# Altium schematic sheet 06 - USB.SchDoc
size A4
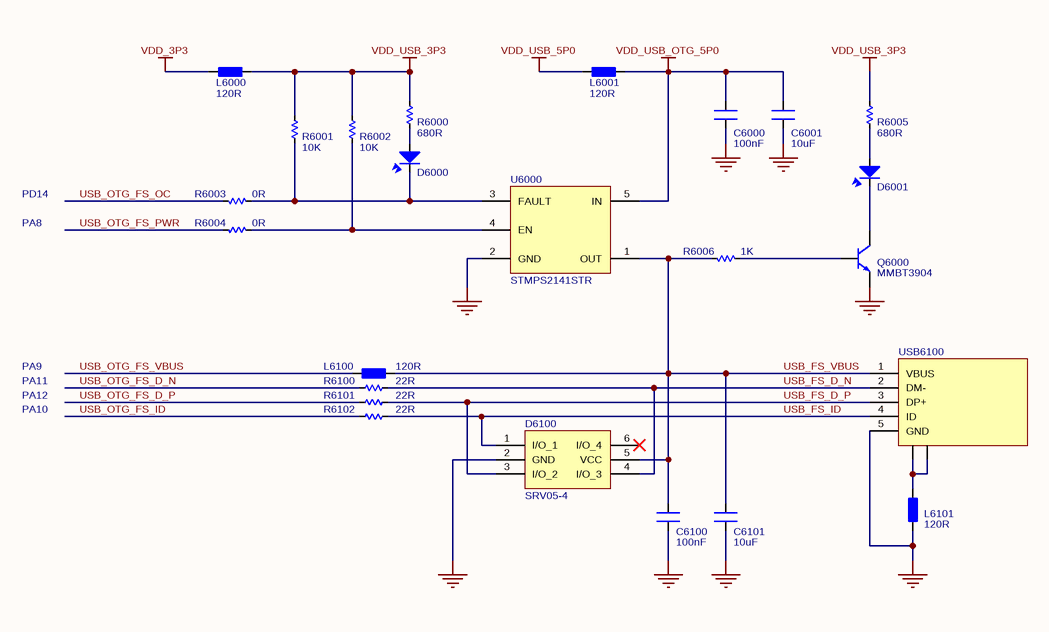
[diagram p0: 06 - USB.SchDoc]

## Parts
C6000  value 100nF  [CN-SMD-0402]  (hidden comment: Capacitor)
C6001  value 10uF  [CN-SMD-0603]  (hidden comment: Capacitor)
C6100  value 100nF  [CN-SMD-0603]  (hidden comment: Capacitor)
C6101  value 10uF  [CN-SMD-0603]  (hidden comment: Capacitor)
D6000  LED  [LED-SMD-0805-RED]  (value not drawn)
D6001  LED  [LED-SMD-0805-GREEN]  (value not drawn)
D6100  SRV05-4  [SOT95P280X145-6N]
L6000  value 120R  [L-SMD-0402]  (hidden comment: Ferrite bead)
L6001  value 120R  [L-SMD-0603]  (hidden comment: Ferrite bead)
L6100  value 120R  [L-SMD-0603]  (hidden comment: Ferrite bead)
L6101  value 120R  [L-SMD-0603]  (hidden comment: Ferrite bead)
Q6000  MMBT3904  [SOT-23-3]
R6000  value 680R  [RES-SMD-0402]  (hidden comment: Resistor)
R6001  value 10K  [RES-SMD-0402]  (hidden comment: Resistor)
R6002  value 10K  [RES-SMD-0402]  (hidden comment: Resistor)
R6003  value 0R  [RES-SMD-0402]  (hidden comment: Resistor)
R6004  value 0R  [RES-SMD-0402]  (hidden comment: Resistor)
R6005  value 680R  [RES-SMD-0402]  (hidden comment: Resistor)
R6006  value 1K  [RES-SMD-0402]  (hidden comment: Resistor)
R6100  value 22R  [RES-SMD-0402]  (hidden comment: Resistor)
R6101  value 22R  [RES-SMD-0402]  (hidden comment: Resistor)
R6102  value 22R  [RES-SMD-0402]  (hidden comment: Resistor)
U6000  STMPS2141STR  [SOT95P280X145-5N]
USB6100  USB  [USB_micro-B_F_SMD-2]  (value not drawn)

## Nets
GND: C6000.1 C6001.1 C6100.1 C6101.1 D6100.2(GND) L6101.1 Q6000.2(Emitter) U6000.2(GND) USB6100.5(GND)
VDD_3P3: L6000.2
VDD_USB_3P3: L6000.1 R6000.1 R6001.1 R6002.1 R6005.1
VDD_USB_5P0: L6001.2
VDD_USB_OTG_5P0: C6000.2 C6001.2 L6001.1 U6000.5(IN)
USB_FS_D_N: D6100.4(I/O_3) R6100.1 USB6100.2(DM-)
USB_FS_D_P: D6100.3(I/O_2) R6101.1 USB6100.3(DP+)
USB_FS_ID: D6100.1(I/O_1) R6102.1 USB6100.4(ID)
USB_FS_VBUS: C6100.2 C6101.2 D6100.5(VCC) L6100.1 R6006.2 U6000.1(OUT) USB6100.1(VBUS)
USB_OTG_FS_D_N: R6100.2
USB_OTG_FS_D_P: R6101.2
USB_OTG_FS_ID: R6102.2
USB_OTG_FS_OC: R6003.2
USB_OTG_FS_PWR: R6004.2
USB_OTG_FS_VBUS: L6100.2
NetD6000_1: D6000.1 R6000.2
NetD6000_2: D6000.2 R6001.2 R6003.1 U6000.3(FAULT)
NetD6001_1: D6001.1 R6005.2
NetD6001_2: D6001.2 Q6000.3(Collector)
NetL6101_2: L6101.2 USB6100.0
NetQ6000_1: Q6000.1(Base) R6006.1
NetR6002_2: R6002.2 R6004.1 U6000.4(EN)

Not connected (* = marked no-connect by the designer): D6100 6(I/O_4)*

## Notes on the sheet
- PA8
- PD14
- PA9
- PA10
- PA11
- PA12

## Library data of the parts
C6000 = Cap: Ceramic Capacitor SMD 0402 100nF ±20% 16V
C6001 C6101 = Cap: Ceramic Capacitor SMD 0603 10uF ±20% 10V
C6100 = Cap: Ceramic Capacitor SMD 0603 100nF ±20% 50V
D6000 = LED: LED red color SMD-0805
D6001 = LED: LED green color SMD-0805
D6100 = SRV05-4: Low capacitance TVS Diode array
L6000 = Ferrite bead: Ferrite bead SMD 0402 120 Ohm @100MHz
L6001 L6100 L6101 = Ferrite bead: Ferrite bead SMD 0603 120 Ohm @100MHz
Q6000 = MMBT3904: 40V NPN small signal transistor SOT-23-5
R6000 R6005 = Res: Resistor SMD 0402 680R 1% 0.063W
R6001 R6002 = Res: Resistor SMD 0402 10K 1% 0.063W
R6003 R6004 = Res: Resistor SMD 0402 0R 1% 0.063W
R6006 = Res: Resistor SMD 0402 1K 1% 0.063W
R6100-R6102 = Res: Resistor SMD 0402 22R 1% 0.063W
U6000 = STMPS2141STR: Enhanced single channel power switches; Manufacturer_Name: STMicroelectronics; Datasheet Link: http://uk.rs-online.com/web/p/products/8805406; Height: 1.45mm; Manufacturer_Part_Number: STMPS2141STR; Mouser Part Number: 511-STMPS2141STR; Mouser Price/Stock: https://www.mouser.com/Search/Refine.aspx?Keyword=511-STMPS2141STR; RS Part Number: 8805406P; RS Price/Stock: http://uk.rs-online.com/web/p/products/8805406P
USB6100 = USB-5: USB female SMD micro-B type